# EAGLE design hexp-001 (EAGLE 9.6.2)
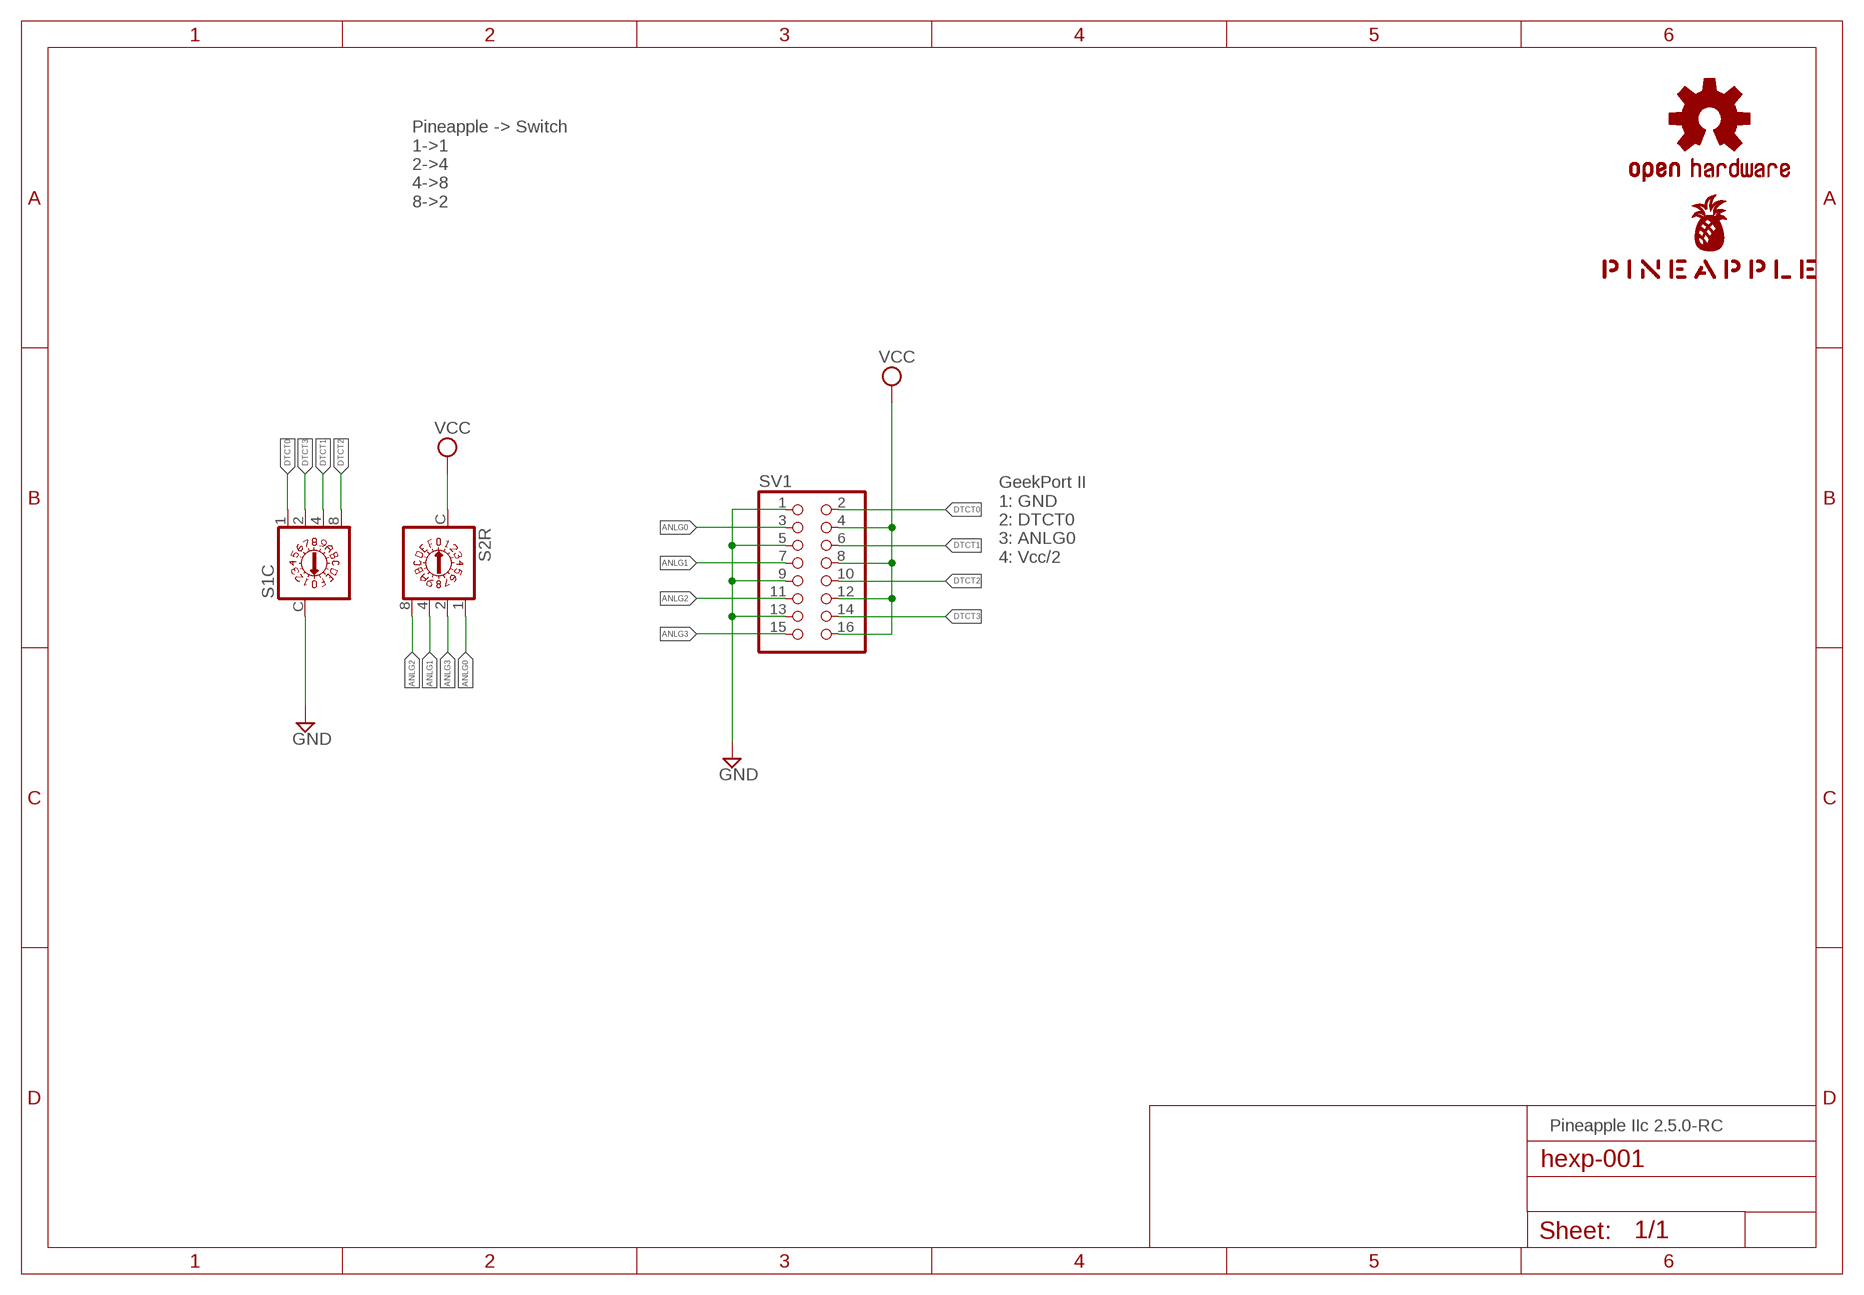
[diagram p0: schematic, sheet 1]

## Parts
LOGO1  OSHW-LOGOS-COPPER  [OSHW-LOGO-S_COPPER]
S1C  A1353HEX  [A1353HEX]
S2R  A1353HEX  [A1353HEX]
SV1  PINHD-2X8  [2X08]
U$1  PINEAPPLE450_SILK  [PINEAPPLE450_SILK]

## Nets
ANLG0: S2R.1 SV1.3
ANLG1: S2R.4 SV1.7
ANLG2: S2R.8 SV1.11
ANLG3: S2R.2 SV1.15
DTCT0: S1C.1 SV1.2
DTCT1: S1C.4 SV1.6
DTCT2: S1C.8 SV1.10
DTCT3: S1C.2 SV1.14
GND: S1C.C SV1.1 SV1.5 SV1.9 SV1.13
VCC: S2R.C SV1.4 SV1.8 SV1.12 SV1.16

## Notes on the sheet
- Pineapple -> Switch
  1->1
  2->4
  4->8
  8->2
- GeekPort II
  1: GND
  2: DTCT0
  3: ANLG0
  4: Vcc/2
- Pineapple IIc 2.5.0-RC

## Library data of the parts
LOGO1 = SparkFun-Aesthetics:OSHW-LOGO: Open-Source Hardware (OSHW) Logo This logo indicates the piece of hardware it is found on incorporates a OSHW license and/or adheres to the definition of open source hardware found here: http://freedomdefined.org/OSHW
S1C S2R = switch-dil:A1353HEX: DIL/CODE SWITCH; OC_FARNELL: unknown; OC_NEWARK: unknown
SV1 = pinhead:PINHD-2X8: PIN HEADER
U$1 = pineapple:PINEAPPLE450_SILK

## Net classes
0 default: width 0.152 mm, drill 0.152 mm, clearance 0.152 mm
1 ground: width 0.305 mm, drill 0.152 mm, clearance 0.152 mm
2 power1: width 0.508 mm, drill 0.152 mm, clearance 0.152 mm
3 power2: width 0.61 mm, drill 0.152 mm, clearance 0.152 mm
4 analog: width 0.305 mm, drill 0.152 mm, clearance 0.152 mm
5 external: width 0.152 mm, drill 0.152 mm, clearance 0.152 mm

## Board
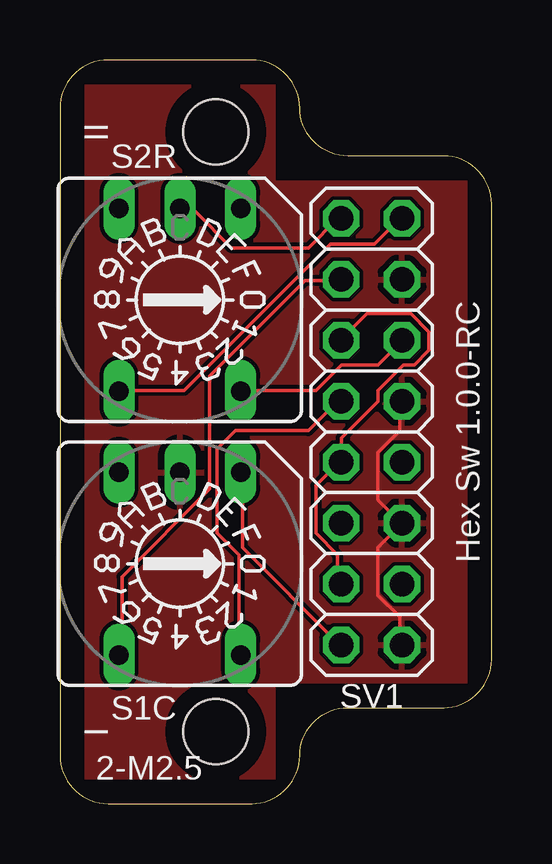
[diagram p1: board, top side]
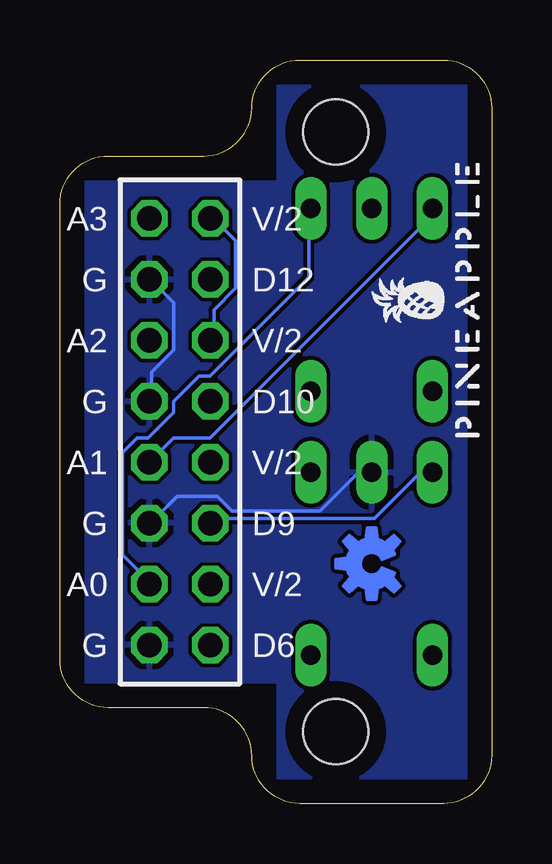
[diagram p2: board, bottom side, seen from below]

Size 18 x 31 mm. Coordinates in mm from the lower left corner, seen from the top.
Outline: 0,29 0,2 arc90 2,0 8,0 arc90 10,2 arc-90 12,4 16,4 arc90 18,6 18,25 arc90 16,27 12,27 arc-90 10,29 arc90 8,31 2,31 arc90 0,29
Copper layers (1*16): Top 0.035mm / dielectric 1.5mm / Bottom 0.035mm
Design rules "SeeedStudio_2layer_DRU_no_angle_20140221": minimum track width 6mil, minimum drill 12mil, track to track 6mil, track to pad 6mil, pad to pad 6mil, via to via 6mil, smd to smd 0mil, copper to edge 10mil, drill to drill 10mil, minimum pad ring 10mil, minimum via ring 6mil, stop-mask expansion 2mil, vias tented up to drill 100mil, thermal gap 10mil
Holes 2.7 mm at 6.5,3 6.5,28
tRestrict: area 4.5,1 to 8.5,5; area 4.5,26 to 8.5,30; area 0,0 to 1,31; area 0,30 to 10,31; area 9,26 to 10,31; area 9,26 to 18,27; area 17,4 to 18,27; area 9,4 to 18,5; area 9,0 to 10,5; area 0,0 to 10,1
bRestrict: area 0,0 to 10,1; area 17,4 to 18,27; area 0,30 to 10,31; area 0,0 to 1,31; area 4.5,1 to 8.5,5; area 4.5,26 to 8.5,30; area 9,26 to 18,27; area 9,4 to 18,5; area 9,0 to 10,5; area 9,26 to 10,31

### Footprints (pad centres in the part's own frame; a part is rotated, then mirrored left to right if it is on the bottom)
A1353HEX = drill 0.813 long: 1 3.81,-2.54; 2 -3.81,2.54; 4 3.81,2.54; 8 -3.81,-2.54; C 3.81,0
2X08 = drill 1.016 octagon: 1 -8.89,-1.27; 2 -8.89,1.27; 3 -6.35,-1.27; 4 -6.35,1.27; 5 -3.81,-1.27; 6 -3.81,1.27; 7 -1.27,-1.27; 8 -1.27,1.27; 9 1.27,-1.27; 10 1.27,1.27; 11 3.81,-1.27; 12 3.81,1.27; 13 6.35,-1.27; 14 6.35,1.27; 15 8.89,-1.27; 16 8.89,1.27

### Placement (x,y rotation side)
LOGO1  5,10 90 bottom
S1C  5,10 90 top
S2R  5,21 90 top
SV1  13,15.5 90 top
U$1  0.5,21 90 bottom

### Tracks (layer width: path | path; a pad name or v marks a point on that pad's centre or on a via)
ANLG0
  Bottom 0.152: S2R.1 7.62,24.69 7.62,21.95 11.73,17.83 12.19,17.83 13.26,16.76 13.26,16.31 14.33,15.24 14.78,15.24 15.39,14.63 15.39,10.36 14.33,9.3 SV1.3
ANLG1
  Bottom 0.152: S2R.4 2.59,24.69 2.59,24.38 11.73,15.24 13.26,15.24 14.17,14.33 SV1.7
ANLG2
  Top 0.152: S2R.8 7.62,17.22 10.67,17.22 11.73,18.29 13.26,18.29 14.17,19.2 SV1.11
ANLG3
  Top 0.152: S2R.2 2.59,17.22 5.18,17.22 11.28,23.32 13.11,23.32 14.17,24.38 SV1.15
DTCT0
  Top 0.152: S1C.1 7.62,13.72 7.62,10.67 11.58,6.71 SV1.2
DTCT1
  Bottom 0.152: S1C.4 2.59,13.72 3.05,13.72 4.88,11.89 11.43,11.89 11.58,11.73 SV1.6
DTCT2
  Top 0.152: S1C.8 7.47,6.25 7.47,10.36 6.55,11.28 6.55,14.78 7.32,15.54 10.36,15.54 11.58,16.76 SV1.10
DTCT3
  Top 0.152: S1C.2 2.59,6.25 2.59,9.45 6.25,13.11 6.25,17.83 10.21,21.79 11.58,21.79 SV1.14
GND
  Top 0.152: SV1.1 14.17,6.71 14.17,7.77 13.26,8.69 13.26,10.67 14.17,11.58 SV1.5 14.17,11.73 13.26,12.65 13.26,14.63 14.17,15.54 14.17,16.76 SV1.9
  Bottom 0.152: SV1.9 14.17,16.92 14.17,17.98 13.26,18.9 13.26,20.88 14.17,21.79 SV1.13 | S1C.C 5.03,13.72 5.64,13.72 7.16,12.19 10.82,12.19 11.43,12.8 13.11,12.8 14.17,11.73 SV1.5
  pour Top: -1,-1 19,-1 19,32 -1,32
  pour Bottom: -2,-2 20,-2 20,33 -2,33
VCC
  Top 0.152: SV1.4 11.58,9.3 11.58,10.36 10.67,11.28 10.67,13.26 11.58,14.17 SV1.8 11.73,14.33 11.73,15.24 13.26,16.76 13.26,17.22 14.33,18.29 14.78,18.29 15.39,18.9 15.39,19.66 14.63,20.42 12.8,20.42 11.73,19.36 SV1.12 | S2R.C 5.03,24.69 5.64,24.69 7.16,23.16 10.36,23.16 11.58,24.38 SV1.16
  Bottom 0.152: SV1.12 11.58,19.36 11.58,20.57 10.67,21.49 10.67,23.47 11.58,24.38 SV1.16

### Text on the board
tNames: II | Hex Sw 1.0.0-RC | I | 2-M2.5
bNames: V/2 | A3 | D12 | G | V/2 | A2 | D10 | G | V/2 | A1 | D9 | G | V/2 | A0 | D6 | G